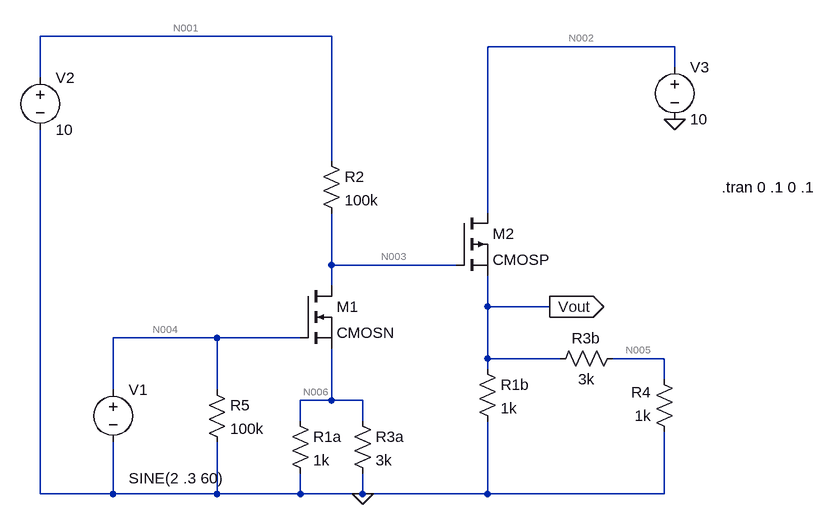
[diagram p0: schematic CD4007_NOFB.asc]
CD4007_NOFB.asc, the LTspice schematic file:
Version 4
SHEET 1 880 680
WIRE 112 -256 -336 -256
WIRE 640 -240 352 -240
WIRE 640 -208 640 -240
WIRE -336 -192 -336 -256
WIRE 112 -64 112 -256
WIRE 352 16 352 -240
WIRE 112 96 112 16
WIRE 304 96 112 96
WIRE 112 128 112 96
WIRE 352 160 352 112
WIRE 448 160 352 160
WIRE -64 208 -224 208
WIRE 64 208 -64 208
WIRE 352 240 352 160
WIRE 464 240 352 240
WIRE 624 240 544 240
WIRE 352 256 352 240
WIRE 624 272 624 240
WIRE -224 288 -224 208
WIRE -64 288 -64 208
WIRE 112 304 112 224
WIRE 112 304 64 304
WIRE 160 304 112 304
WIRE 64 336 64 304
WIRE 160 336 160 304
WIRE -336 448 -336 -112
WIRE -224 448 -224 368
WIRE -224 448 -336 448
WIRE -64 448 -64 368
WIRE -64 448 -224 448
WIRE 64 448 64 416
WIRE 64 448 -64 448
WIRE 160 448 160 416
WIRE 160 448 64 448
WIRE 352 448 352 336
WIRE 352 448 160 448
WIRE 624 448 624 352
WIRE 624 448 352 448
FLAG 448 160 Vout
IOPIN 448 160 Out
FLAG 160 448 0
FLAG 640 -128 0
SYMBOL nmos 64 128 R0
SYMATTR InstName M1
SYMATTR Value CMOSN
SYMBOL pmos 304 16 R0
SYMATTR InstName M2
SYMATTR Value CMOSP
SYMBOL res 48 320 R0
SYMATTR InstName R1a
SYMATTR Value 1k
SYMBOL res 144 320 R0
SYMATTR InstName R3a
SYMATTR Value 3k
SYMBOL res 336 240 R0
SYMATTR InstName R1b
SYMATTR Value 1k
SYMBOL res 560 224 R90
WINDOW 0 0 56 VBottom 2
WINDOW 3 32 56 VTop 2
SYMATTR InstName R3b
SYMATTR Value 3k
SYMBOL res 640 368 R180
WINDOW 0 36 76 Left 2
WINDOW 3 36 40 Left 2
SYMATTR InstName R4
SYMATTR Value 1k
SYMBOL voltage -224 272 R0
WINDOW 3 24 152 Left 2
WINDOW 123 24 124 Left 2
WINDOW 39 0 0 Left 2
SYMATTR InstName V1
SYMATTR Value SINE(2 .3 60)
SYMBOL res -80 272 R0
SYMATTR InstName R5
SYMATTR Value 100k
SYMBOL res 96 -80 R0
SYMATTR InstName R2
SYMATTR Value 100k
SYMBOL voltage -336 -208 R0
WINDOW 123 0 0 Left 2
WINDOW 39 0 0 Left 2
SYMATTR InstName V2
SYMATTR Value 10
SYMBOL voltage 640 -224 R0
WINDOW 123 0 0 Left 2
WINDOW 39 0 0 Left 2
SYMATTR InstName V3
SYMATTR Value 10
TEXT 712 -24 Left 2 !.tran 0 .1 0 .1

The netlist it stands for:
* CD4007_NOFB.asc
M1 N003 N004 N006 N006 CMOSN
M2 N002 N003 Vout Vout CMOSP
R1a N006 0 1k
R3a N006 0 3k
R1b Vout 0 1k
R3b N005 Vout 3k
R4 0 N005 1k
V1 N004 0 SINE(2 .3 60)
R5 N004 0 100k
R2 N001 N003 100k
V2 N001 0 10
V3 N002 0 10
.model NMOS NMOS
.model PMOS PMOS
.lib standard.mos
.tran 0 .1 0 .1
.backanno
.end

* Results of the author's LTspice run, read from the files saved beside the schematic
* Operating Point, zero values left out:
*   V(n003) = 7.793 V
*   V(n004) = 2 V
*   V(n006) = 16.55 mV
*   V(n002) = 10 V
*   V(vout) = 9.225 V
*   V(n005) = 2.306 V
*   V(n001) = 10 V
*   Id(M2) = 11.53 mA
*   Ib(M2) = -10.47 mA
*   Is(M2) = -1.065 mA
*   Id(M1) = 22.07 µA
*   Ib(M1) = -7.778 pA
*   Is(M1) = -22.07 µA
*   I(R2) = 22.07 µA
*   I(R5) = 20 µA
*   I(R4) = -2.306 mA
*   I(R3b) = -2.306 mA
*   I(R1b) = 9.225 mA
*   I(R3a) = 5.517 µA
*   I(R1a) = 16.55 µA
*   I(V3) = -11.53 mA
*   I(V2) = -22.07 µA
*   I(V1) = -20 µA
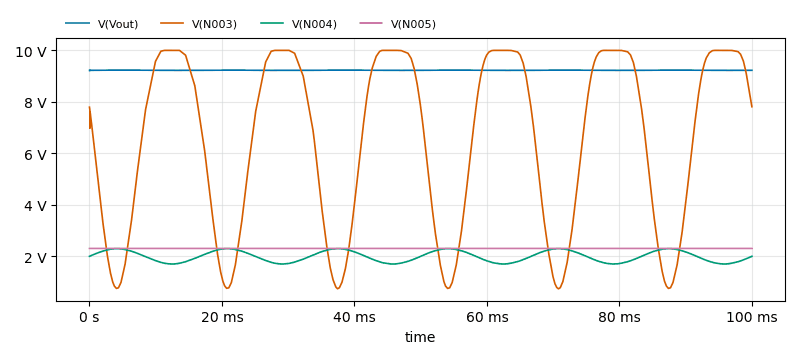
[diagram p1: Transient Analysis of CD4007_NOFB.asc, plotted from the saved traces]
* Transient Analysis, 1 run:
*   V(Vout): min 9.208 V, max 9.236 V, average 9.227 V, rms 9.227 V, last 9.225 V
*   V(N003): min 738.1 mV, max 10 V, average 6.523 V, rms 7.368 V, last 7.811 V
*   V(N004): min 1.701 V, max 2.299 V, average 2 V, rms 2.011 V, last 2 V
*   V(N005): min 2.302 V, max 2.309 V, average 2.307 V, rms 2.307 V, last 2.306 V